# EAGLE design soldering_station (EAGLE 7.4.0)
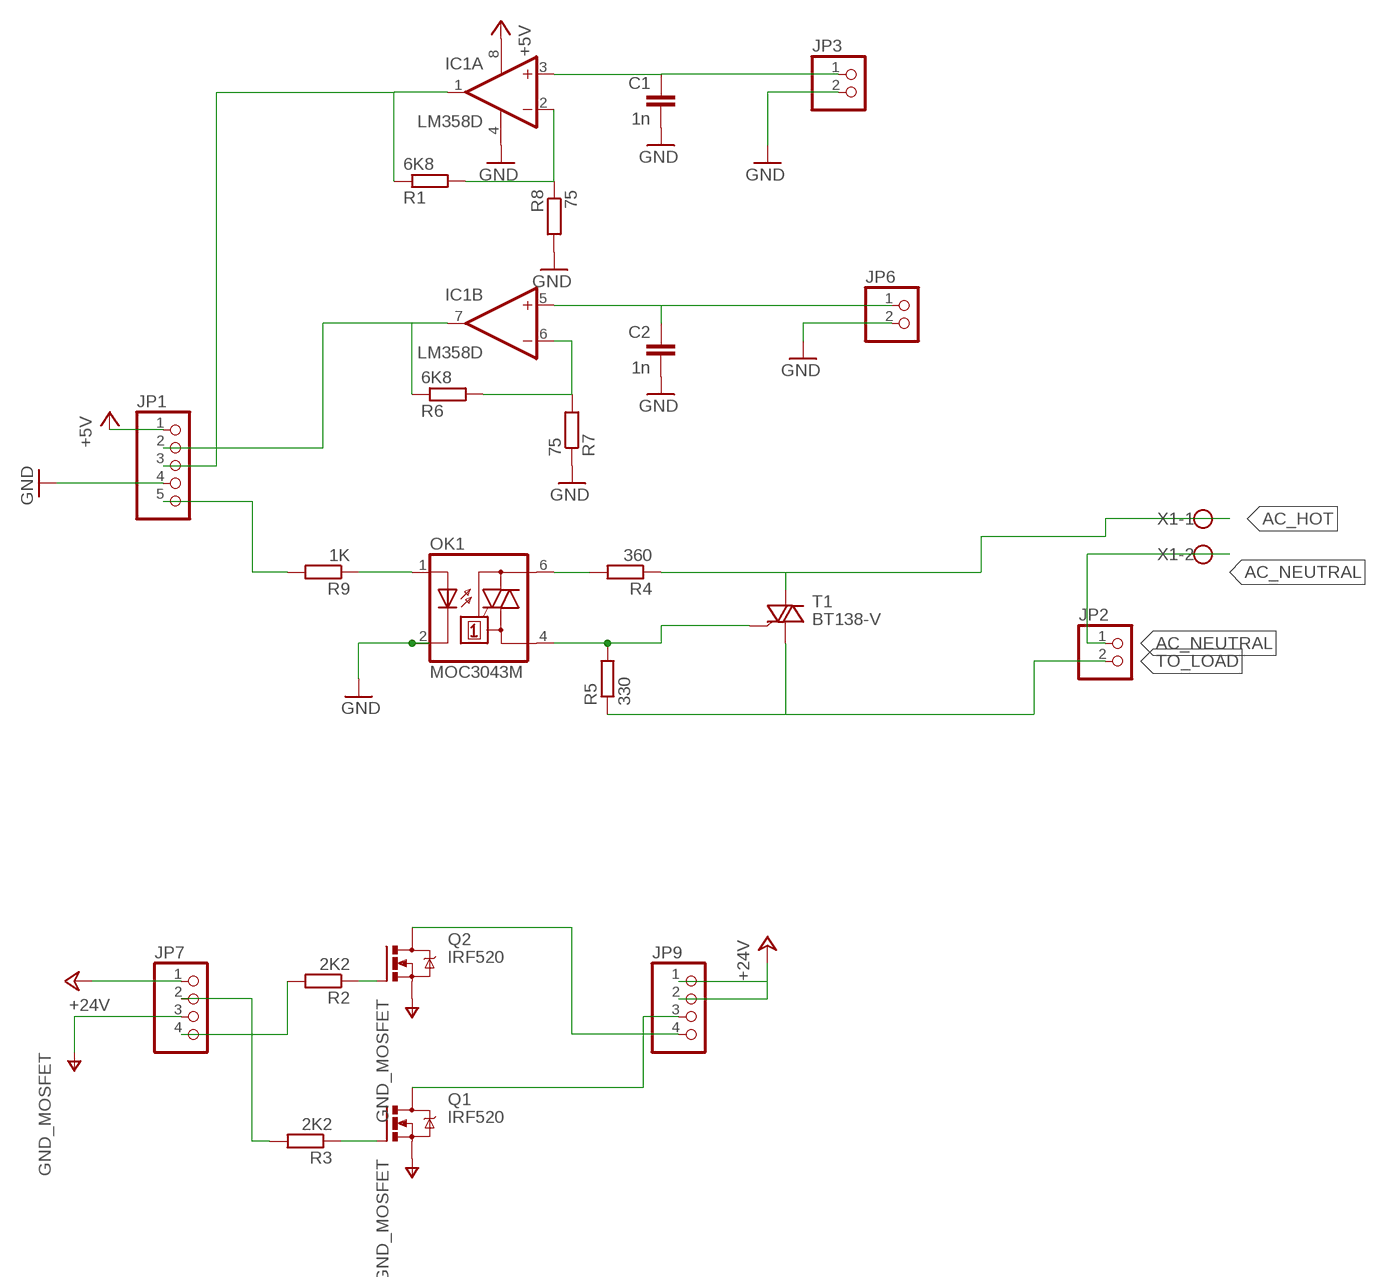
[diagram p0: schematic, sheet 1]

## Parts
C1  1n  C-EUC0805  [C0805]
C2  1n  C-EUC0805  [C0805]
IC1  LM358D  [SO08]
JP1  PINHD-1X5  [1X05]
JP2  PINHD-1X2  [1X02]
JP3  PINHD-1X2  [1X02]
JP6  PINHD-1X2  [1X02]
JP7  PINHD-1X4  [1X04]
JP9  PINHD-1X4  [1X04]
OK1  MOC3043M  [DIL06]
Q1  IRF520  [TO220BV]
Q2  IRF520  [TO220BV]
R1  6K8  R-EU_R0805  [R0805]
R2  2K2  R-EU_R0805  [R0805]
R3  2K2  R-EU_R0805  [R0805]
R4  360  R-EU_R0805  [R0805]
R5  330  R-EU_R0805  [R0805]
R6  6K8  R-EU_R0805  [R0805]
R7  75  R-EU_R0805  [R0805]
R8  75  R-EU_R0805  [R0805]
R9  1K  R-EU_R0805  [R0805]
T1  BT138-V  [TO220BV]
X1  W237-102  [W237-102]

## Nets
+5V: IC1.8(P:V+) JP1.1
+24V: JP7.1 JP9.1 JP9.2
AC_HOT: R4.1 T1.T2(A2) X1.1
AC_NEUTRAL: JP2.1 X1.2
GND: C1.2 C2.2 IC1.4(P:V-) JP1.4 JP3.2 JP6.2 OK1.2(C) R7.1 R8.2
N$1: C1.1 IC1.3(A:+IN) JP3.1
N$2: IC1.1(A:OUT) JP1.3 R1.1
N$3: IC1.2(A:-IN) R1.2 R8.1
N$4: IC1.7(B:OUT) JP1.2 R6.1
N$5: IC1.6(B:-IN) R6.2 R7.2
N$7: Q1.G R3.1
N$8: Q2.G R2.1
N$9: OK1.6(A2) R4.2
N$11: OK1.4(A1) R5.2 T1.G
N$12: OK1.1(A) R9.1
N$13: JP1.5 R9.2
N$14: C2.1 IC1.5(B:+IN) JP6.1
N$16: JP7.4 R2.2
N$17: JP7.2 R3.2
N$20: JP9.4 Q2.D
N$21: JP9.3 Q1.D
TO_LOAD: JP2.2 R5.1 T1.T1(A1)
V-: JP7.3 Q1.S Q2.S ; supply symbol labelled GND_MOSFET

## Library data of the parts
C1 C2 = resistor:C-EU: CAPACITOR, European symbol
IC1 = linear:LM358: OP AMP also LM158; LM258; LM2904 Source: http://cache.national.com/ds/LM/LM158.pdf
JP1 = pinhead:PINHD-1X5: PIN HEADER
JP2 JP3 JP6 = pinhead:PINHD-1X2: PIN HEADER
JP7 JP9 = pinhead:PINHD-1X4: PIN HEADER
OK1 = optocoupler:MOC30*: 6-Pin DIP Zero-Cross Optoisolators Triac Driver Output (250/400 Volt Peak) Source: Data sheet <http://www.fairchildsemi.com/ds/MO/MOC3031M.pdf> The old path of data sheet not more available 2013-05-06.; MF: FAIRCHILD SEMICONDUCTOR; MPN: MOC3043-M; OC_FARNELL: 1021371; OC_NEWARK: 72K8900
Q1 Q2 = transistor-power:IRF520: HEXFET Power MOSFET
R1-R9 = resistor:R-EU_: RESISTOR, European symbol
T1 = triac:BT138: TRIAC Source: http://www.semiconductors.philips.com BT138_SERIES_2.pdf
X1 = con-wago-500:W237-102: WAGO SCREW CLAMP; MPN: 237-102; OC_FARNELL: unknown; OC_NEWARK: 70K9898

## Board
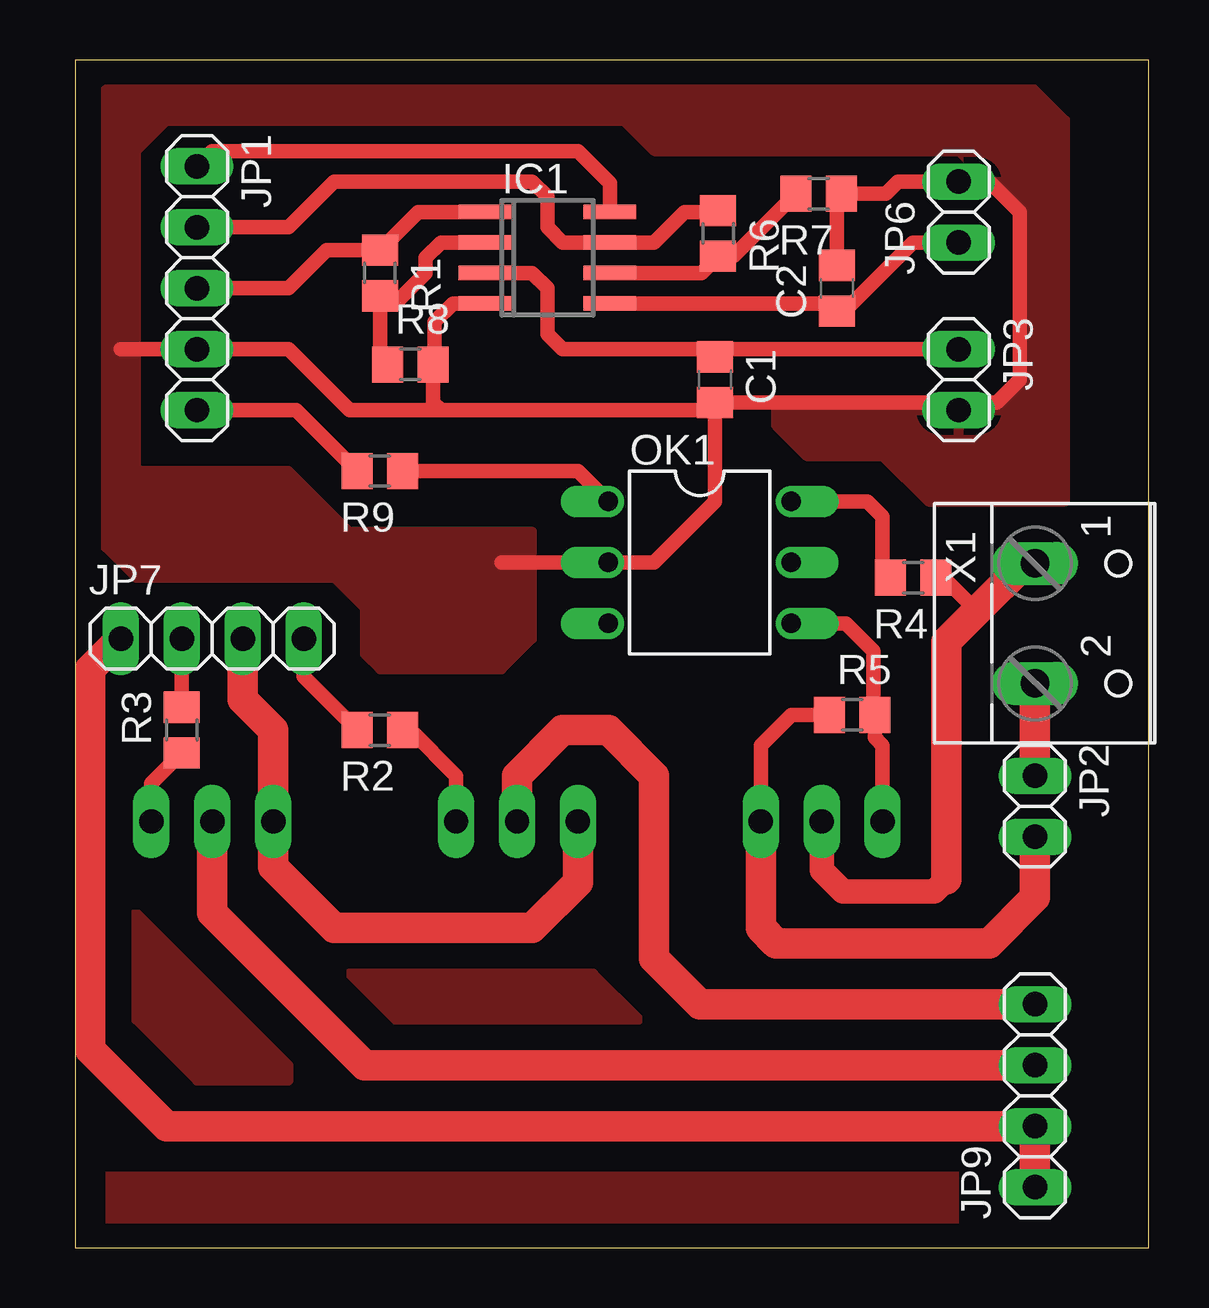
[diagram p1: board, top side]
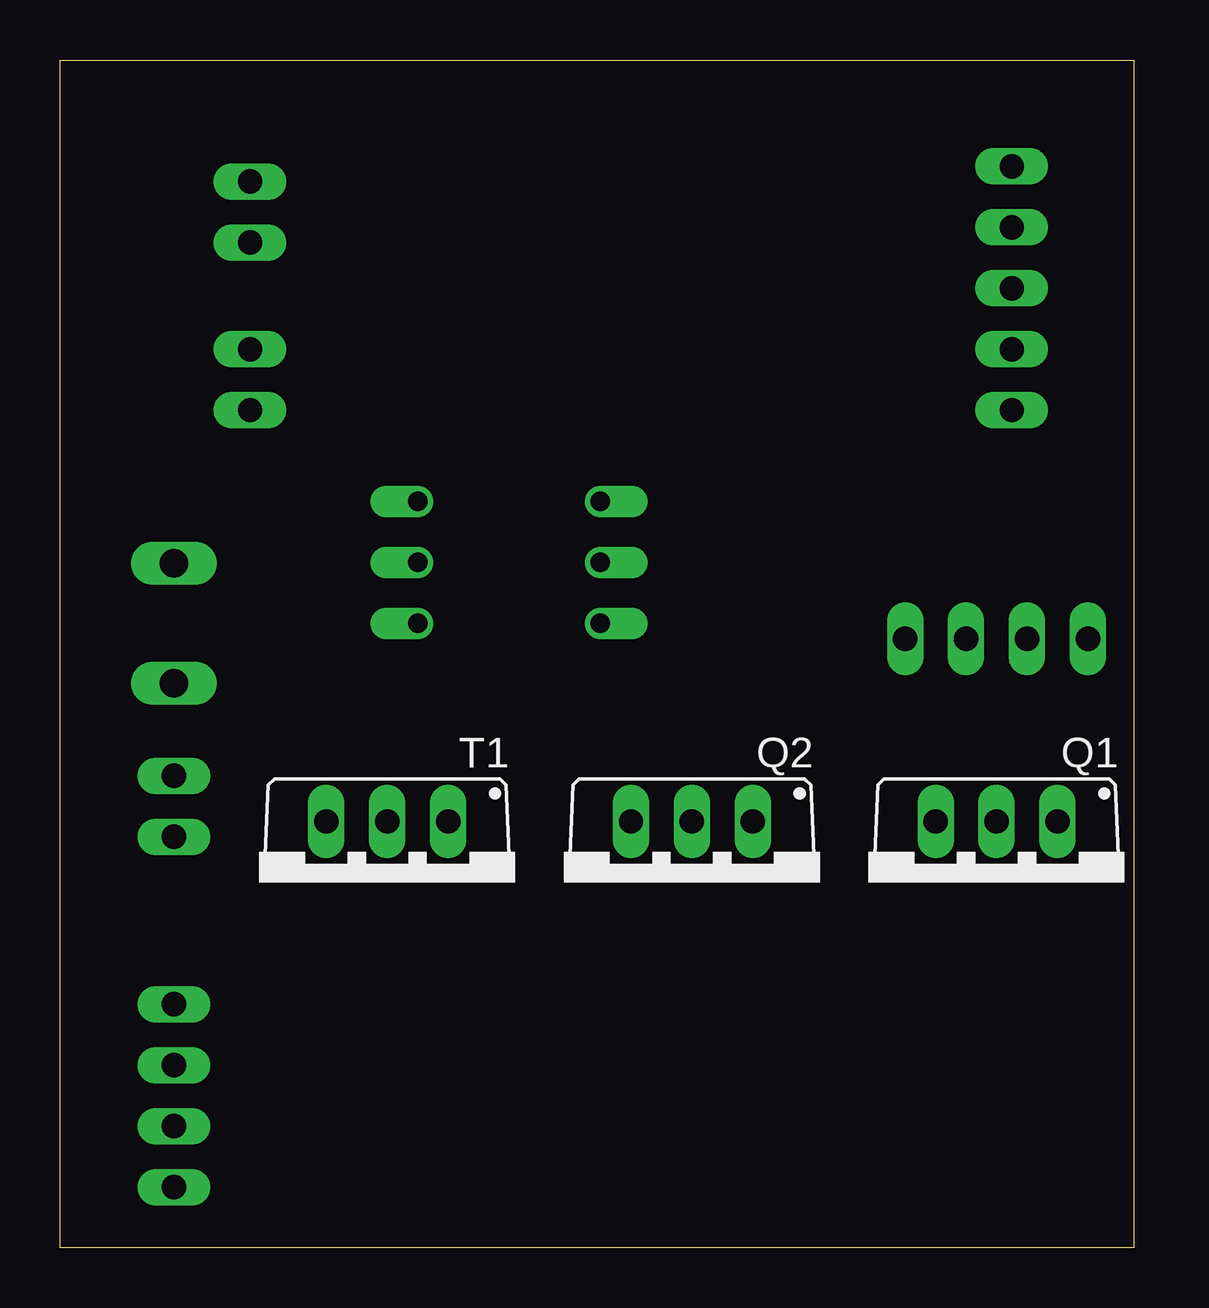
[diagram p2: board, bottom side, seen from below]

Size 44.75 x 49.52 mm. Coordinates in mm from the lower left corner, seen from the top.
Outline: 0,0 44.75,0 44.75,49.52 0,49.52 0,0
Copper layers (1*16): Top 0.035mm / dielectric 1.5mm / Bottom 0.035mm
Design rules "default": minimum track width 10mil, minimum drill 24mil, track to track 8mil, track to pad 8mil, pad to pad 8mil, via to via 8mil, smd to smd 8mil, copper to edge 40mil, drill to drill 8mil, minimum pad ring 10mil, minimum via ring 8mil, stop-mask expansion 4mil, vias tented up to drill 0mil, thermal gap 10mil

### Footprints (pad centres in the part's own frame; a part is rotated, then mirrored left to right if it is on the bottom)
C0805 = smd 1.3 x 1.5: 1 -0.95,0; 2 0.95,0
SO08 = smd 0.6 x 2.2: 1 -1.905,-2.6; 2 -0.635,-2.6; 3 0.635,-2.6; 4 1.905,-2.6; 5 1.905,2.6; 6 0.635,2.6; 7 -0.635,2.6; 8 -1.905,2.6
1X05 = drill 1.016 long: 1 -5.08,0; 2 -2.54,0; 3 0,0; 4 2.54,0; 5 5.08,0
1X02 = drill 1.016 long: 1 -1.27,0; 2 1.27,0
1X04 = drill 1.016 long: 1 -3.81,0; 2 -1.27,0; 3 1.27,0; 4 3.81,0
DIL06 = drill 0.813 offset: 1 -2.54,-3.81; 2 0,-3.81; 3 2.54,-3.81; 4 2.54,3.81; 5 0,3.81; 6 -2.54,3.81
TO220BV = drill 1.016 long: D 0,-2.54; G -2.54,-2.54; S 2.54,-2.54
R0805 = smd 1.3 x 1.5: 1 -0.95,0; 2 0.95,0
TO220BV' = drill 1.016 long: G 2.54,-2.54; T1 -2.54,-2.54; T2 0,-2.54
W237-102 = drill 1.194 long: 1 -2.5,-1.27; 2 2.5,-1.27

### Placement (x,y rotation side)
C1  26.67,36.2 270 top
C2  31.75,40.01 90 top
IC1  19.68,41.27 270 top
JP1  5.08,40.01 270 top
JP2  40,18.41 270 top
JP3  36.83,36.2 270 top
JP6  36.83,43.18 90 top
JP7  5.71,25.4 0 top
JP9  40,6.35 90 top
OK1  26.04,28.57 270 top
Q1  5.71,15.24 180 bottom
Q2  18.41,15.24 180 bottom
R1  12.7,40.64 270 top
R2  12.7,21.59 180 top
R3  4.45,21.59 90 top
R4  34.92,27.94 180 top
R5  32.38,22.22 0 top
R6  26.8,42.29 270 top
R7  30.99,43.94 180 top
R8  13.97,36.83 0 top
R9  12.7,32.39 180 top
T1  BT138-V  [TO220BV']  31.11,15.24 180 bottom
X1  41.27,26.04 270 top

### Tracks (layer width: path | path; a pad name or v marks a point on that pad's centre or on a via)
+5V
  Top 0.61: IC1.8 22.29,44.39 20.96,45.72 5.71,45.72 JP1.1
+24V
  Top 1.27: JP7.1 0.64,24.13 0.64,8.26 3.81,5.08 JP9.2 JP9.1
AC_HOT
  Top 0.406: R4.1 36.2,27.94
  Top 0.61: 36.2,27.94 37.59,26.54
  Top 1.016: T1.T2 31.11,15.75 32,14.86 35.81,14.86 36.32,15.37 | X1.1 39.58,28.54
  Top 1.27: 39.58,28.54 37.59,26.54 36.32,25.27 36.32,15.37
AC_NEUTRAL
  Top 1.27: X1.2 JP2.1
GND
  Top 0.406: IC1.4 16.51,39.37 | 31.75,43.75 R7.1
  Top 0.61: 16.51,39.37 15.75,39.37 14.99,38.61 14.99,36.9 R8.2 14.92,35.25 15.24,34.93 | 15.24,34.93 11.43,34.93 8.89,37.47 JP1.4 1.9,37.47 | 15.24,34.93 26.35,34.93 C1.2 | C1.2 26.67,31.11 24.13,28.57 OK1.2 17.78,28.57 | 31.75,43.75 C2.2 | R7.1 33.78,43.94 34.29,44.45 JP6.2 38.1,44.45 39.37,43.18 39.37,36.2 38.42,35.25 36.51,35.25 | C1.2 36.51,35.25 | 36.51,35.25 JP3.2
  pour Top: 12.7,24.13 17.78,24.13 19.05,25.4 19.05,29.84 11.43,29.84 8.89,32.39 2.54,32.39 2.54,45.72 3.81,46.99 22.86,46.99 24.13,45.72 36.83,45.72 39.37,43.18 39.37,36.2 38.1,34.93 29.21,34.93 29.21,34.29 30.48,33.02 33.65,33.02 35.56,31.11 41.27,31.11 41.27,46.99 39.37,48.9 1.9,48.9 1.27,48.26 1.27,29.21 2.54,27.94 10.79,27.94 12.07,26.67 12.07,24.76
N$1
  Top 0.406: 26.99,37.47 C1.1
  Top 0.61: IC1.3 19.05,40.64 19.68,40.01 19.68,38.1 20.32,37.47 26.35,37.47 C1.1 | 26.99,37.47 JP3.1
N$2
  Top 0.61: IC1.1 14.29,43.18 R1.1 10.47,41.59 8.89,40.01 JP1.3
N$3
  Top 0.61: IC1.2 15.24,41.91 14.61,41.27 14.61,40.64 13.34,39.37 13.02,39.37 R1.2 12.7,37.15 R8.1
N$4
  Top 0.61: JP1.2 8.89,42.55 10.79,44.45 19.05,44.45 19.68,43.82 19.68,42.55 20.32,41.91 IC1.7 24.13,41.91 25.4,43.18 26.74,43.18 R6.1
N$5
  Top 0.61: IC1.6 26.1,40.64 R6.2 27.44,41.34 R7.2
N$6
  pour Top: 2.54,13.97 2.54,9.53 5.08,6.99 8.89,6.99 8.89,7.62
N$7
  Top 0.61: Q1.G 3.18,19.37 R3.1
N$8
  Top 0.61: R2.1 13.97,21.59 15.88,19.68 Q2.G
N$9
  Top 0.61: OK1.6 33.02,31.11 33.65,30.48 33.65,28.26 R4.2
N$10
  pour Top: 11.43,11.43 13.34,9.53 23.5,9.53 21.59,11.43
N$11
  Top 0.61: T1.G 33.65,20.95 33.33,21.27 R5.2 33.27,22.29 33.27,24.89 32.13,26.04 OK1.4
N$12
  Top 0.61: R9.1 20.96,32.39 OK1.1
N$13
  Top 0.61: JP1.5 9.21,34.93 R9.2
N$14
  Top 0.61: IC1.5 31.43,39.37 C2.1 32.07,39.05 34.92,41.91 JP6.1
N$15
  pour Top: 1.27,3.17 36.83,3.17 36.83,0.64 1.27,0.64
N$16
  Top 0.61: JP7.4 9.53,23.81 R2.2
N$17
  Top 0.61: JP7.2 R3.2
N$20
  Top 1.27: Q2.D 18.41,19.68 20.32,21.59 22.23,21.59 24.13,19.68 24.13,12.06 26.04,10.16 JP9.4
N$21
  Top 1.27: JP9.3 12.07,7.62 5.71,13.97 Q1.D
TO_LOAD
  Top 0.61: R5.1 29.84,22.22 28.57,20.95 T1.T1
  Top 1.27: JP2.2 40,14.61 38.1,12.7 29.21,12.7 28.57,13.34 T1.T1
V-
  Top 1.27: Q2.S 20.96,15.24 19.05,13.34 10.79,13.34 8.26,15.88 Q1.S 8.26,21.59 6.99,22.86 JP7.3

### Text on the board
tRestrict: Soldering station 2016